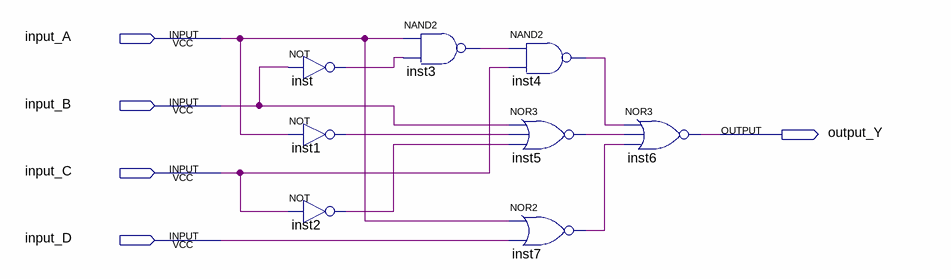
[diagram p0: schematic sheet]
// Quartus schematic TaskOneVarSix.bdf as structural Verilog: 8 symbols, 5 pins
module TaskOneVarSix (
  input  input_A,
  input  input_B,
  input  input_C,
  input  input_D,
  output output_Y
);

  wire inst1_out, inst2_out, inst3_out, inst4_out, inst5_out, inst7_out, inst_out;

  not inst (inst_out, input_B);
  not inst1 (inst1_out, input_A);
  not inst2 (inst2_out, input_C);
  nand inst3 (inst3_out, input_A, inst_out);
  nand inst4 (inst4_out, inst3_out, input_C);
  nor inst5 (inst5_out, input_B, inst1_out, inst2_out);
  nor inst7 (inst7_out, input_A, input_D);
  nor inst6 (output_Y, inst4_out, inst5_out, inst7_out);
endmodule
